# Altium project RPlan_LB.PrjPCB
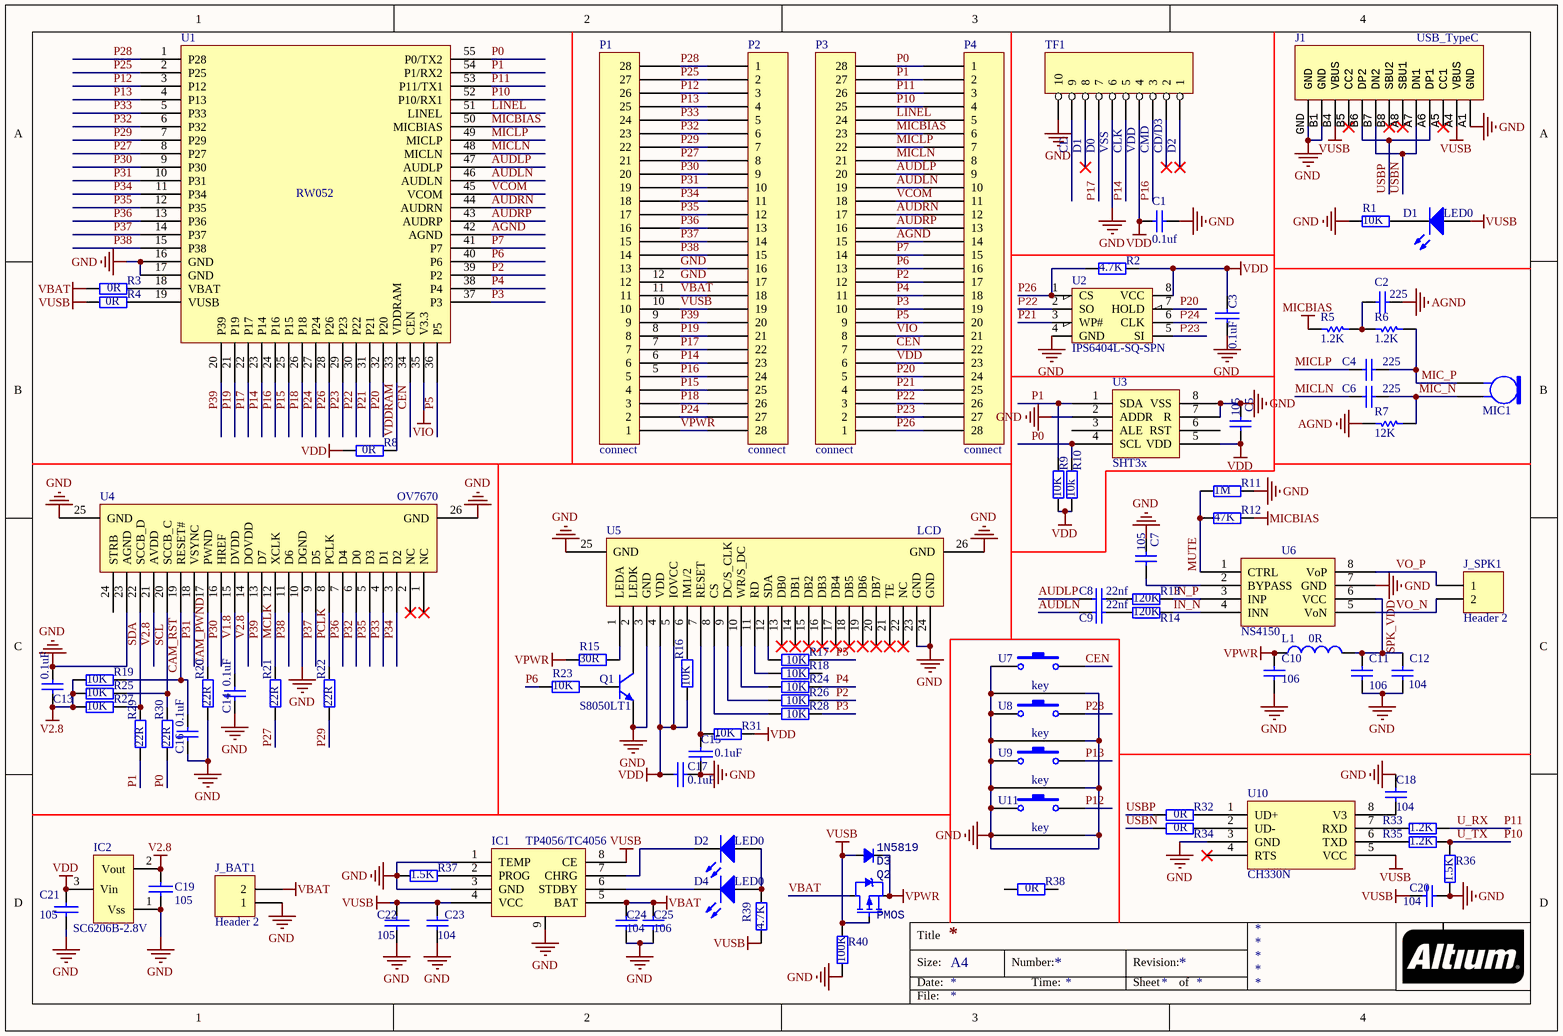
[diagram p0: RPlan_LB.SchDoc]
1 sheet, 94 parts. Net scope: global (net labels, ports and power ports of the same name join across sheets).
Board file: RPlan_LB.PcbDoc

## Sheet RPlan_LB.SchDoc
size A4

### Parts
C1  0.1uf  [0603C]
C2  225  [0603C]
C3  0.1uF  [0603C]
C4  225  [0603C]
C5  105  [0603C]
C6  225  [0603C]
C7  105  [0603C]
C8  22nf  [0603C]
C9  22nf  [0603C]
C10  106  [0603C]
C11  106  [0603C]
C12  104  [0603C]
C13  value 0.1uF  [0603C]
C14  value 0.1uF  [0603C]
C15  0.1uF  [0603C]
C16  value 0.1uF  [0603C]
C17  0.1uF  [0603C]
C18  104  [0603C]
C19  105  [0603C]
C20  104  [0603C]
C21  105  [0603C]
C22  105  [0603C]
C23  104  [0603C]
C24  104  [0603C]
C25  106  [0603C]
D1  LED0  [0603_LED_R]
D2  LED0  [0603_LED_R]
D3  1N5819  [SOD-323]
D4  LED0  [0603_LED_G]
IC1  TP4056/TC4056  [SOP8_150mil]
IC2  SC6206B-2.8V  [SOT-23-3]
J1  USB_TypeC  [USB_TypeC]
J_BAT1  Header 2  [BAT]
J_SPK1  Header 2  [MIC_4015_DIP]
L1  0R  [0603C]
MIC1  MIC  [MIC_4015_DIP]  (value not drawn)
P1  connect  [CONNECT2]
P2  connect  [CONNECT]
P3  connect  [CONNECT]
P4  connect  [CONNECT2]
Q1  S8050LT1  [SOT-23-3]
Q2  PMOS  [SOT-23-3]
R1  10K  [0603C]
R2  4.7K  [0603C]
R3  value 0R  [0603C]
R4  value 0R  [0603C]
R5  1.2K  [0603C]
R6  1.2K  [0603C]
R7  12K  [0603C]
R8  value 0R  [0603C]
R9  10K  [0603C]
R10  10k  [0603C]
R11  1M  [0603C]
R12  47K  [0603C]
R13  120K  [0603C]
R14  120K  [0603C]
R15  value 30R  [0603C]
R16  value 10K  [0603C]
R17  value 10K  [0603C]
R18  value 10K  [0603C]
R19  value 10K  [0603C]
R20  value 22R  [0603C]
R21  value 22R  [0603C]
R22  value 22R  [0603C]
R23  value 10K  [0603C]
R24  value 10K  [0603C]
R25  value 10K  [0603C]
R26  value 10K  [0603C]
R27  value 10K  [0603C]
R28  value 10K  [0603C]
R29  value 22R  [0603C]
R30  value 22R  [0603C]
R31  value 10K  [0603C]
R32  0R  [0603C]
R33  1.2K  [0603C]
R34  0R  [0603C]
R35  1.2K  [0603C]
R36  1.5K  [0603C]
R37  1.5K  [0603C]
R38  0R  [LCD_13]
R39  4.7K  [0603C]
R40  100K  [0603C]
TF1  (no value)  [TF1]
U1  RW052  [RW052]
U2  IPS6404L-SQ-SPN  [SOP8_150mil]
U3  SHT3x  [SHT3X]
U4  OV7670  [FPC_0.5_24P_L]
U5  LCD  [FPC_0.5_24P_LF]
U6  NS4150  [SOP8_150mil]
U7  key  [KEY]
U8  key  [KEY]
U9  key  [KEY]
U10  CH330N  [SOP8_150mil]
U11  key  [KEY]

### Nets
AGND: C2.2 P3.15 P4.14 R7.1 U1.42(AGND)
GND: C1.2 C3.1 C5.2 C7.2 C10.2 C11.2 C12.1 C13.2 C14.1 C15.1 C16.1 C17.2 C18.2 C19.2 C20.2 C21.2 C22.1 C23.2 C24.2 C25.1 IC1.1(TEMP) IC1.3(GND) IC1.9(PAD) IC2.1(Vss) J1.A1(GND) J1.B1(GND) J1.GND J_BAT1.1 P1.12 P1.13 P2.16 P2.17 Q1.2(E) R1.1 R11.2 R20.1 R36.1 R37.2 R40.1 TF1.6 TF1.10 U1.16(GND) U1.17(GND) U2.4(GND) U3.2(ADDR) U3.7(R) U3.8(VSS) U4.10(DGND) U4.23(AGND) U4.25(GND) U4.26(GND) U5.3(GND) U5.23(GND) U5.24(GND) U5.25(GND) U5.26(GND) U6.7(GND) U7.1 U7.3 U7.4 U8.1 U8.3 U8.4 U9.1 U9.3 U9.4 U10.3(GND) U11.1 U11.3 U11.4
MICBIAS: P3.23 P4.6 R5.1 R12.2 U1.50(MICBIAS)
V2.8: C13.1 C19.1 IC2.2(Vout) R19.2 R25.2 R27.2 U4.14(DOVDD) U4.21(AVDD)
VBAT: C24.1 C25.2 IC1.5(BAT) J_BAT1.2 P1.11 P2.18 Q2.3(D) R3.2
VDD: C1.1 C3.2 C5.1 C17.1 C21.1 IC2.3(Vin) P3.6 P4.23 R2.1 R8.2 R9.2 R10.2 R16.2 R31.1 TF1.4 U2.8(VCC) U3.5(VDD) U5.4(VDD) U5.5(IOVCC)
VIO: P3.8 P4.21 U1.35(V3.3)
VPWR: C10.1 D3.2(K) L1.1 P1.1 P2.28 Q2.2(S) R15.2
VUSB: C20.1 C22.2 C23.1 D1.1(A) D3.1(A) IC1.4(VCC) IC1.8(CE) J1.A4(VBUS) J1.B4(VBUS) P1.10 P2.19 Q2.1(G) R4.2 R39.2 R40.2 U10.5(VCC)
AUDLN: C9.2 P3.19 P4.10 U1.46(AUDLN)
AUDLP: C8.2 P3.20 P4.9 U1.47(AUDLP)
AUDRN: P3.17 P4.12 U1.44(AUDRN)
AUDRP: P3.16 P4.13 U1.43(AUDRP)
CAM_PWND: R20.2 U4.17(PWND)
CAM_RST: C16.2 R19.1 U4.19(RESET#)
CEN: P3.7 P4.22 U1.34(CEN) U7.2
IN_N: R14.2 U6.4(INN)
IN_P: R13.1 U6.3(INP)
LINEL: P3.24 P4.5 U1.51(LINEL)
MCLK: R21.2 U4.12(XCLK)
MIC_N: C6.1 MIC1.2 R7.2
MIC_P: C4.1 MIC1.1 R6.1
MICLN: C6.2 P3.21 P4.8 U1.48(MICLN)
MICLP: C4.2 P3.22 P4.7 U1.49(MICLP)
MUTE: R11.1 R12.1 U6.1(CTRL)
P0: P3.28 P4.1 R10.1 R30.1 U1.55(P0/TX2) U3.4(SCL)
P1: P3.27 P4.2 R9.1 R29.1 U1.54(P1/RX2) U3.1(SDA)
P2: P3.12 P4.17 R26.1 U1.39(P2)
P3: P3.10 P4.19 R28.1 U1.37(P3)
P4: P3.11 P4.18 R24.1 U1.38(P4)
P5: P3.9 P4.20 R17.1 U1.36(P5)
P6: P3.13 P4.16 R23.2 U1.40(P6)
P7: P3.14 P4.15 U1.41(P7)
P10: P3.25 P4.4 R35.1 R36.2 U1.52(P10/RX1)  [also labelled U_TX]
P11: P3.26 P4.3 R33.1 U1.53(P11/TX1)  [also labelled U_RX]
P12: P1.26 P2.3 U1.3(P12) U11.2
P13: P1.25 P2.4 U1.4(P13) U9.2
P14: P1.6 P2.23 TF1.5 U1.23(P14)
P15: P1.4 P2.25 U1.25(P15)
P16: P1.5 P2.24 TF1.3 U1.24(P16)
P17: P1.7 P2.22 TF1.7 U1.22(P17)
P18: P1.3 P2.26 U1.26(P18)
P19: P1.8 P2.21 U1.21(P19)
P20: P3.5 P4.24 U1.32(P20) U2.7(HOLD)
P21: P3.4 P4.25 U1.31(P21) U2.3(WP#)
P22: P3.3 P4.26 U1.30(P22) U2.2(SO)
P23: P3.2 P4.27 U1.29(P23) U2.5(SI)
P24: P1.2 P2.27 U1.27(P24) U2.6(CLK)
P25: P1.27 P2.2 U1.2(P25)
P26: P3.1 P4.28 R2.2 U1.28(P26) U2.1(CS)
P27: P1.21 P2.8 R21.1 U1.8(P27)
P28: P1.28 P2.1 U1.1(P28) U8.2
P29: P1.22 P2.7 R22.2 U1.7(P29)
P30: P1.20 P2.9 U1.9(P30) U4.16(HREF)
P31: P1.19 P2.10 U1.10(P31) U4.18(VSYNC)
P32: P1.23 P2.6 U1.6(P32) U4.6(D0)
P33: P1.24 P2.5 U1.5(P33) U4.4(D1)
P34: P1.18 P2.11 U1.11(P34) U4.3(D2)
P35: P1.17 P2.12 U1.12(P35) U4.5(D3)
P36: P1.16 P2.13 U1.13(P36) U4.7(D4)
P37: P1.15 P2.14 U1.14(P37) U4.9(D5)
P38: P1.14 P2.15 U1.15(P38) U4.11(D6)
P39: P1.9 P2.20 U1.20(P39) U4.13(D7)
PCLK: R22.1 U4.8(PCLK)
SCL: R25.1 R30.2 U4.20(SCCB_C)
SDA: R27.1 R29.2 U4.22(SCCB_D)
SPK_VDD: C11.1 C12.2 L1.2 U6.6(VCC)
USBN: J1.A7(DN1) J1.B7(DN2) R34.2
USBP: J1.A6(DP1) J1.B6(DP2) R32.2
V1.8: C14.2 U4.15(DVDD)
VCOM: P3.18 P4.11 U1.45(VCOM)
VDDRAM: R8.1 U1.33(VDDRAM)
VO_N: J_SPK1.2 U6.5(VoN)
VO_P: J_SPK1.1 U6.8(VoP)
NetC2_1: C2.1 R5.2 R6.2
NetC7_1: C7.1 U6.2(BYPASS)
NetC8_1: C8.1 R13.2
NetC9_1: C9.1 R14.1
NetC15_2: C15.2 R31.2 U5.7(RESET)
NetC18_1: C18.1 U10.8(V3)
NetD1_2: D1.2(K) R1.2
NetD2_1: D2.1(A) D4.1(A) R39.1
NetD2_2: D2.2(K) IC1.7(CHRG)
NetD4_2: D4.2(K) IC1.6(STDBY)
NetIC1_2: IC1.2(PROG) R37.1
NetQ1_1: Q1.1(B) R23.1
NetQ1_3: Q1.3(C) U5.2(LEDK)
NetR3_1: R3.1 U1.18(VBAT)
NetR4_1: R4.1 U1.19(VUSB)
NetR15_1: R15.1 U5.1(LEDA)
NetR16_1: R16.1 U5.6(IM1/2)
NetR17_2: R17.2 U5.12(SDA)
NetR18_2: R18.2 U5.11(RD)
NetR24_2: R24.2 U5.10(WR/S_DC)
NetR26_2: R26.2 U5.9(DC/S_CLK)
NetR28_2: R28.2 U5.8(CS)
NetR32_1: R32.1 U10.1(UD+)
NetR33_2: R33.2 U10.7(RXD)
NetR34_1: R34.1 U10.2(UD-)
NetR35_2: R35.2 U10.6(TXD)

Not connected (* = marked no-connect by the designer): J1 A5(CC1)* A8(SBU1)* B5(CC2)* B8(SBU2)*; R18 1; R38 1 2; TF1 1* 2* 8* 9; U3 3(ALE) 6(RST); U4 1(NC)* 2(NC)* 24(STRB); U5 13(DB0)* 14(DB1)* 15(DB2)* 16(DB3)* 17(DB4)* 18(DB5)* 19(DB6)* 20(DB7)* 21(TE)* 22(NC)*; U10 4(RTS)*

### Notes on the sheet
- (near TF1) CD
- (near TF1) D1
- (near TF1) D0
- (near TF1) VSS
- (near TF1) CLK
- (near TF1) VDD
- CMD
- (near TF1) CD/D3
- D2
- Title
- Size:
- Date:
- A4
- Number:
- Time:
- Revision:
- Sheet
- of
- File:

### Library data of the parts
C1 C5 C7-C11 C13 C14 C16 C18 C20 C23-C25 = Cap: Capacitor; Published: 8-Jun-2000; LatestRevisionDate: 17-Jul-2002; LatestRevisionNote: Re-released for DXP Platform.; PackageReference: RAD-0.3; Publisher: Altium Limited
  C13 C14 C16: PackageDescription: Radial Cap, Thru-Hole; 2 Leads; 0.3 in Pin Spacing
C2 C4 C6 C12 = CAP
C3 C15 C17 C19 C21 C22 = CAP: Capacitor
  C3: Value: 0.1uF
  C22: Value: 105
D1 D2 D4 = LED0: Typical INFRARED GaAs LED; Published: 8-Jun-2000; LatestRevisionDate: 08-Jul-2005; LatestRevisionNote: Mech Layer 1 removed.; PackageReference: LED-0; Publisher: Altium Limited; PackageDescription: LED; 2 Leads
D3 = Diode_SOD123: Diode; Type: SOD123; Value: 1N5819
IC1 = 4056
IC2 = ME6206A33M3G: SC6206B-3V
J1 = USB_TypeC: USB
J_BAT1 J_SPK1 = Header 2: Header, 2-Pin; LatestRevisionDate: 17-Jul-2002; LatestRevisionNote: Re-released for DXP Platform.; Publisher: Altium Limited
L1 = Inductor: GZ1608D121TF; Code_IEC: 1005; Published: 8-Jun-2000; LatestRevisionDate: 17-Jul-2002; LatestRevisionNote: Re-released for DXP Platform.; PackageReference: 0402-A; Publisher: Altium Limited; Code_JEITA: 0402
Q1 = NPN: NPN Bipolar Transistor; Published: 8-Jun-2000; LatestRevisionDate: 17-Jul-2002; LatestRevisionNote: Re-released for DXP Platform.; PackageReference: TO-226; Publisher: Altium Limited; Code_JEDEC: TO-226-AA
Q2 = MOSFET_P_SOT23: MOSFET; Value: PMOS
R1 R2 R9-R14 R32-R40 = RES
  R1 R9: Value: 10K
  R2 R39: Value: 4.7K
  R10: Value: 10k
  R11: Value: 1M
  R12: Value: 47K
  R13 R14: Value: 120K
  R32 R34 R38: Value: 0R
  R33 R35: Value: 1.2K
  R36 R37: Value: 1.5K
  R40: Value: 100K
R3 R4 R8 R15-R31 = Res2: Resistor; Published: 8-Jun-2000; LatestRevisionDate: 17-Jul-2002; LatestRevisionNote: Re-released for DXP Platform.; PackageReference: AXIAL-0.4; Publisher: Altium Limited; PackageDescription: Axial Device, Thru-Hole; 2 Leads; 0.4 in Pin Spacing
R5-R7 = Res
TF1 = HEADER 10
U2 = W25X16